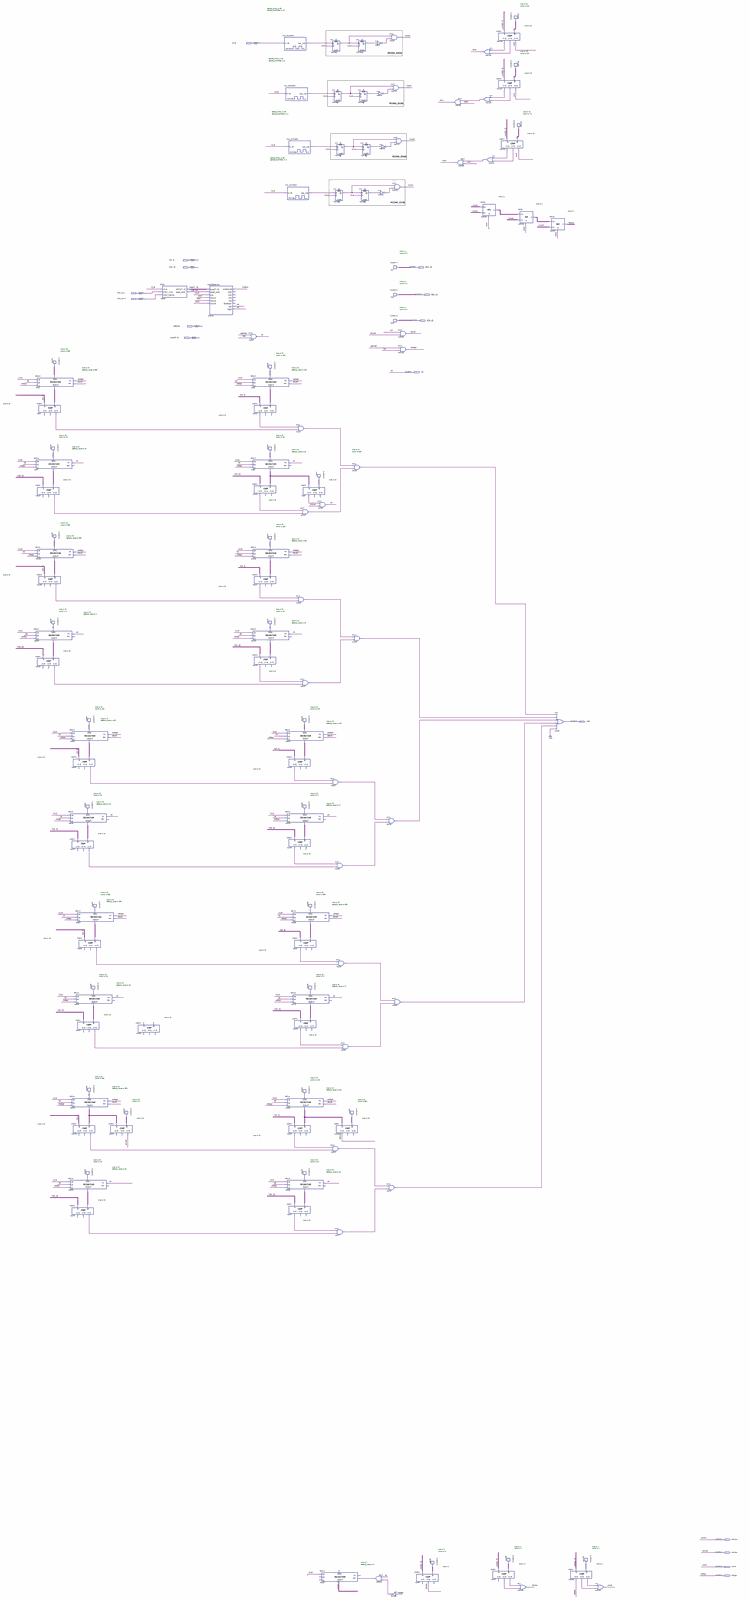
[diagram p0: schematic sheet, whole]
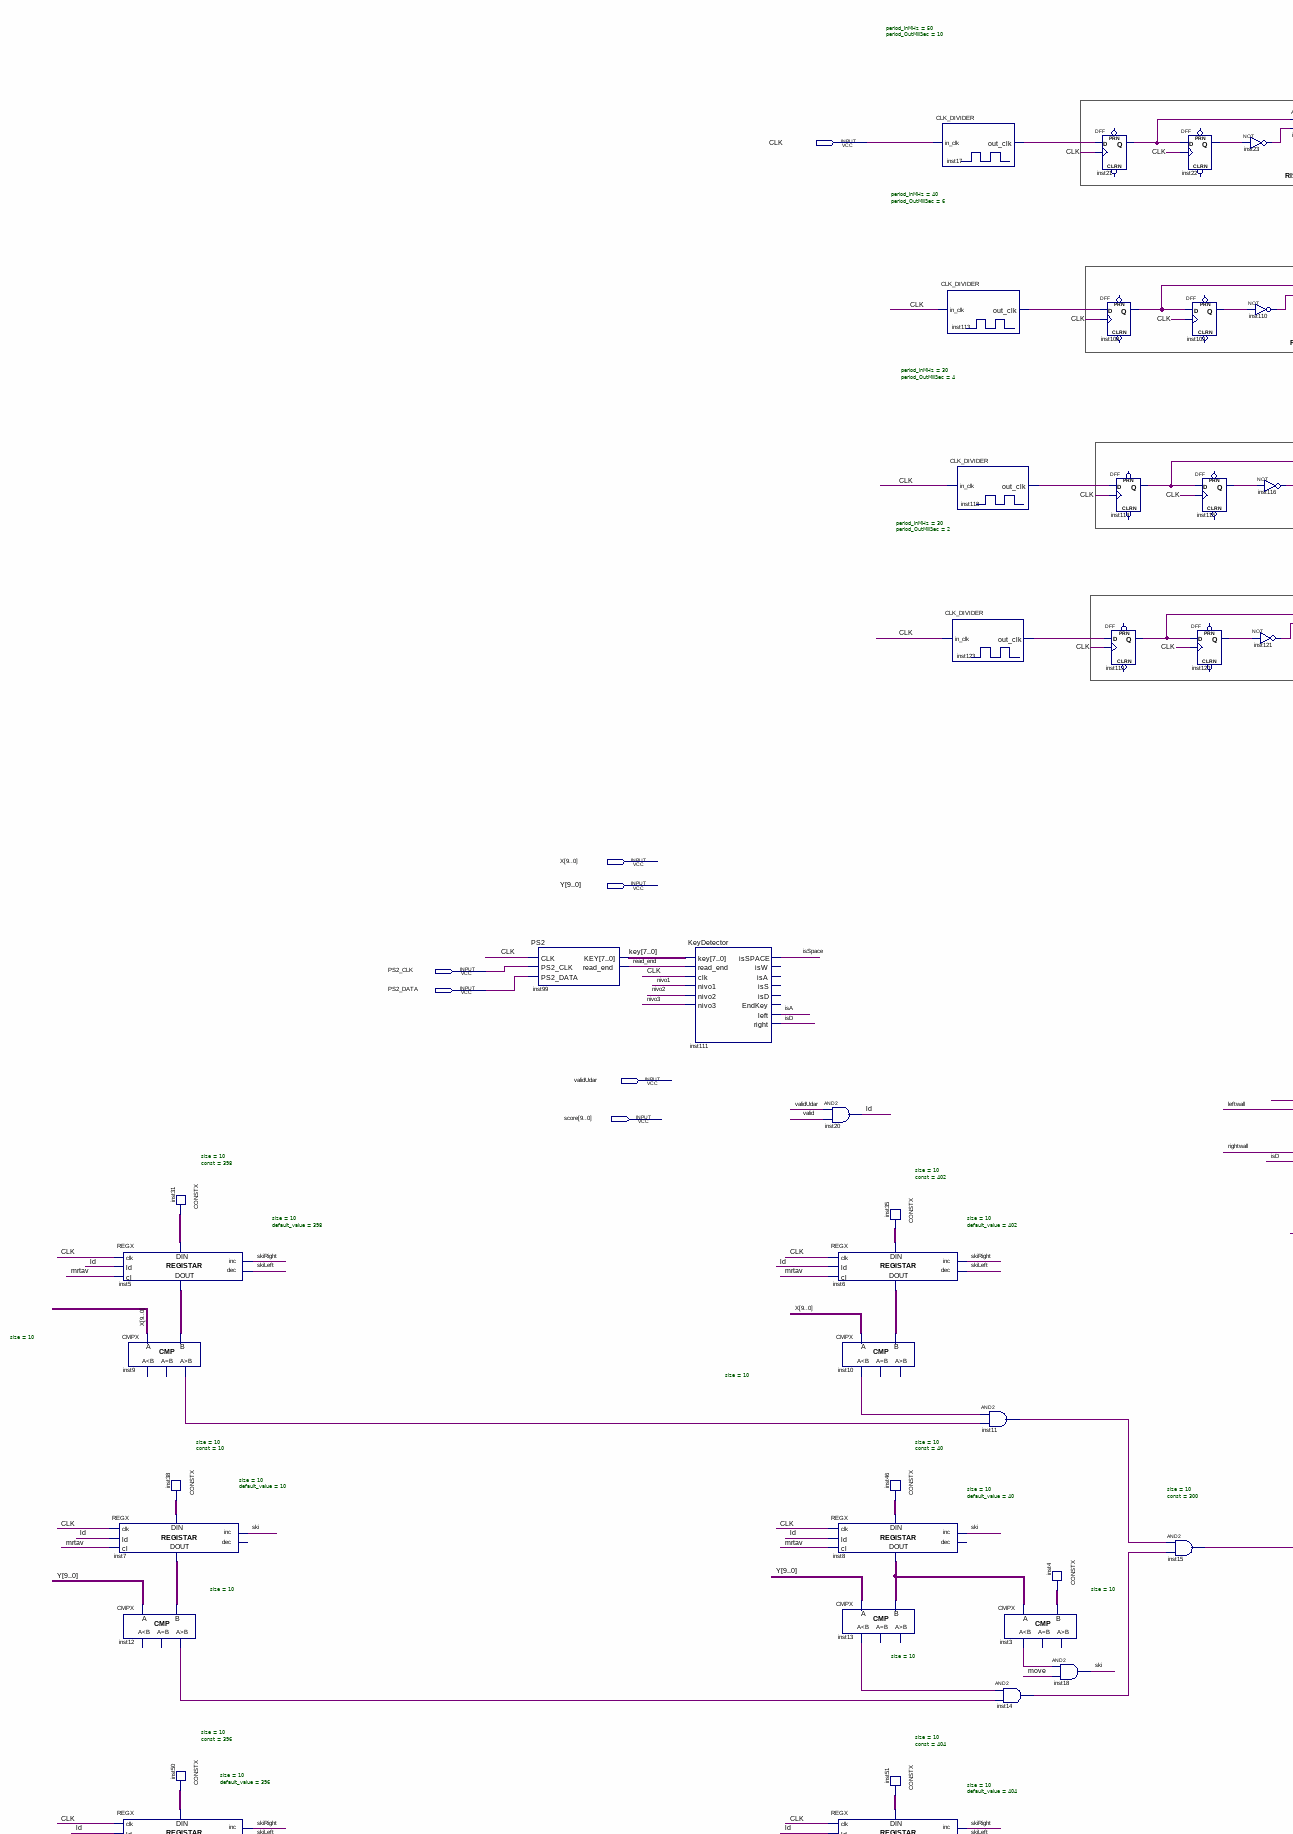
[diagram p1: schematic sheet, upper left part]
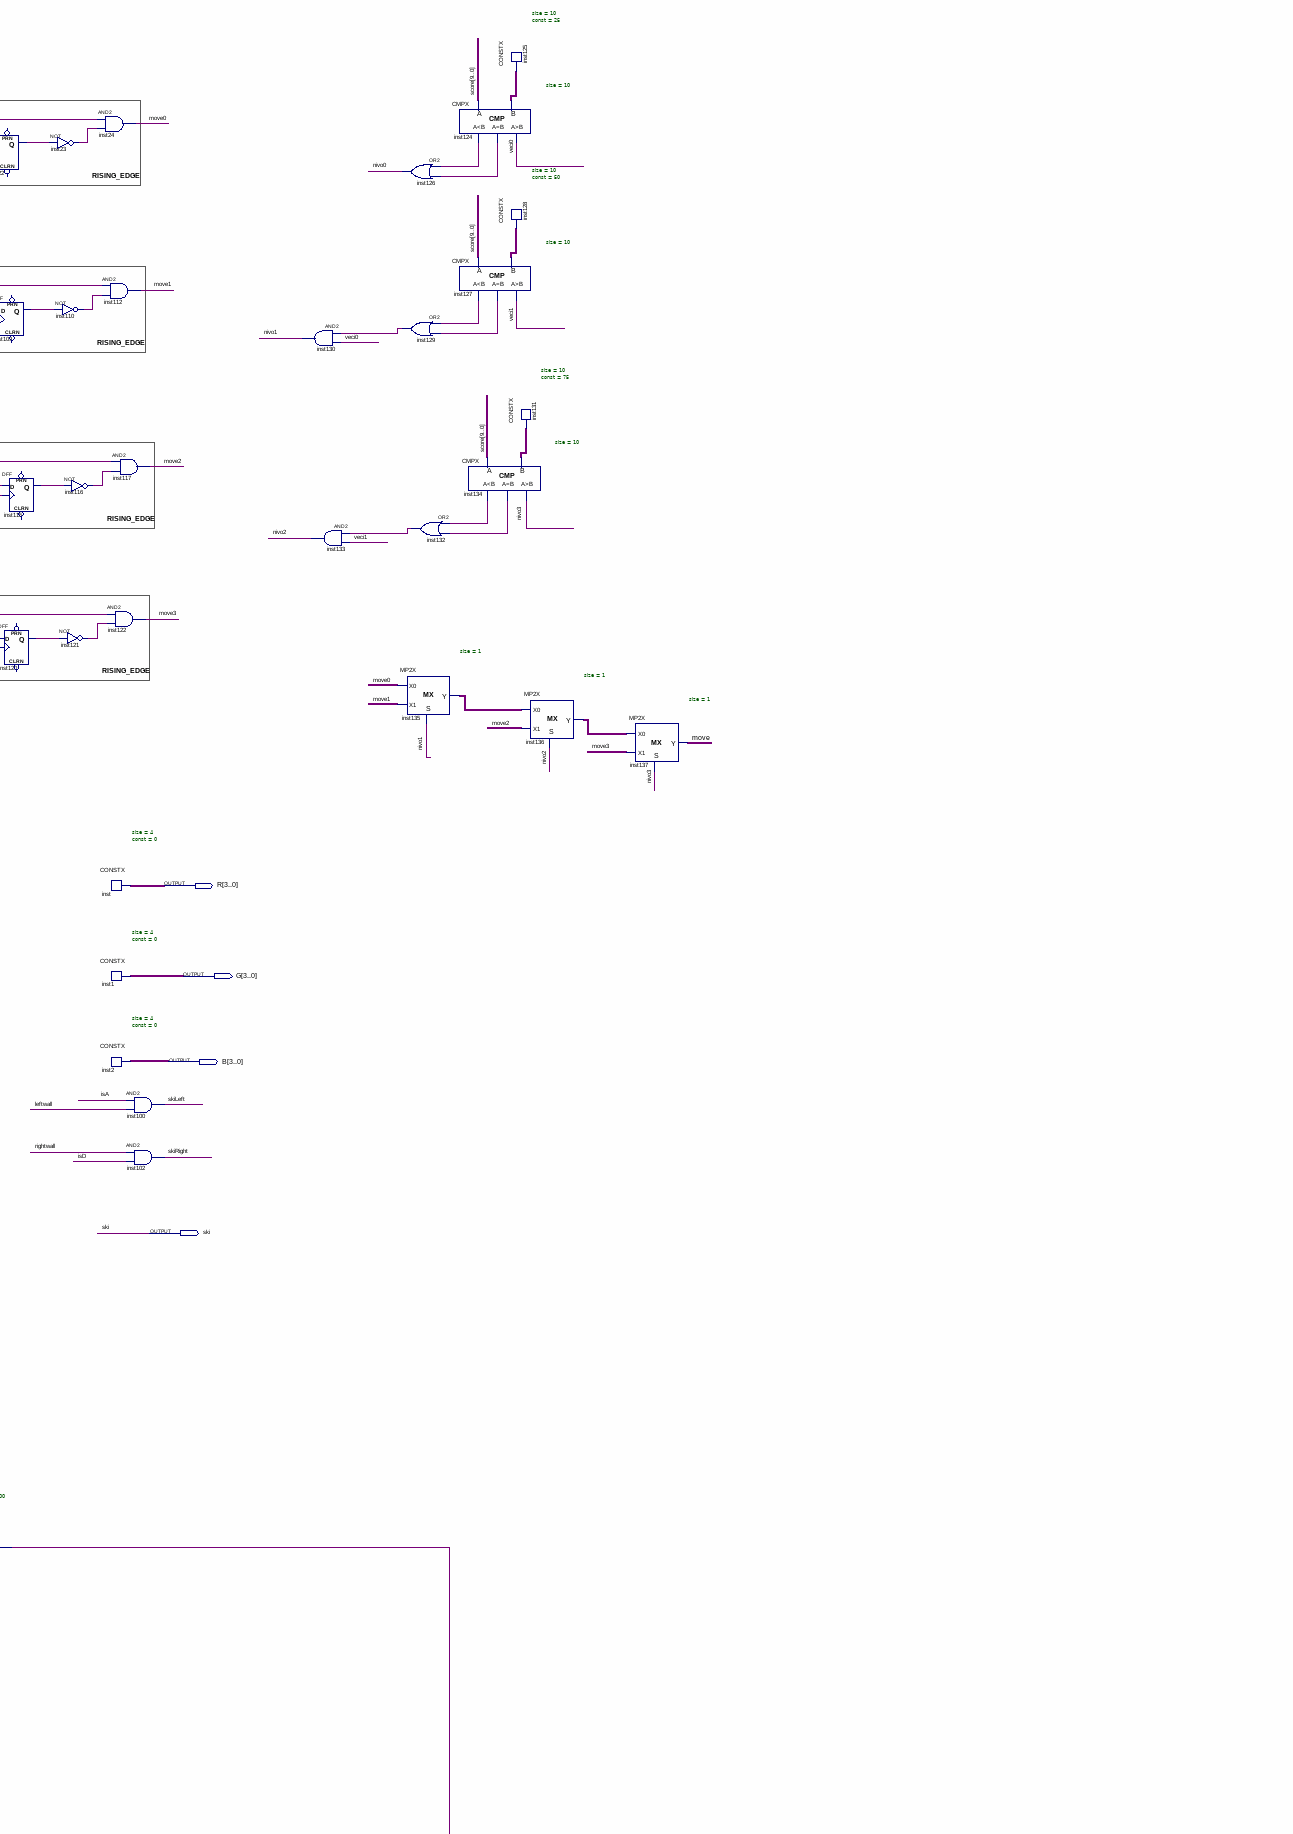
[diagram p2: schematic sheet, upper right part]
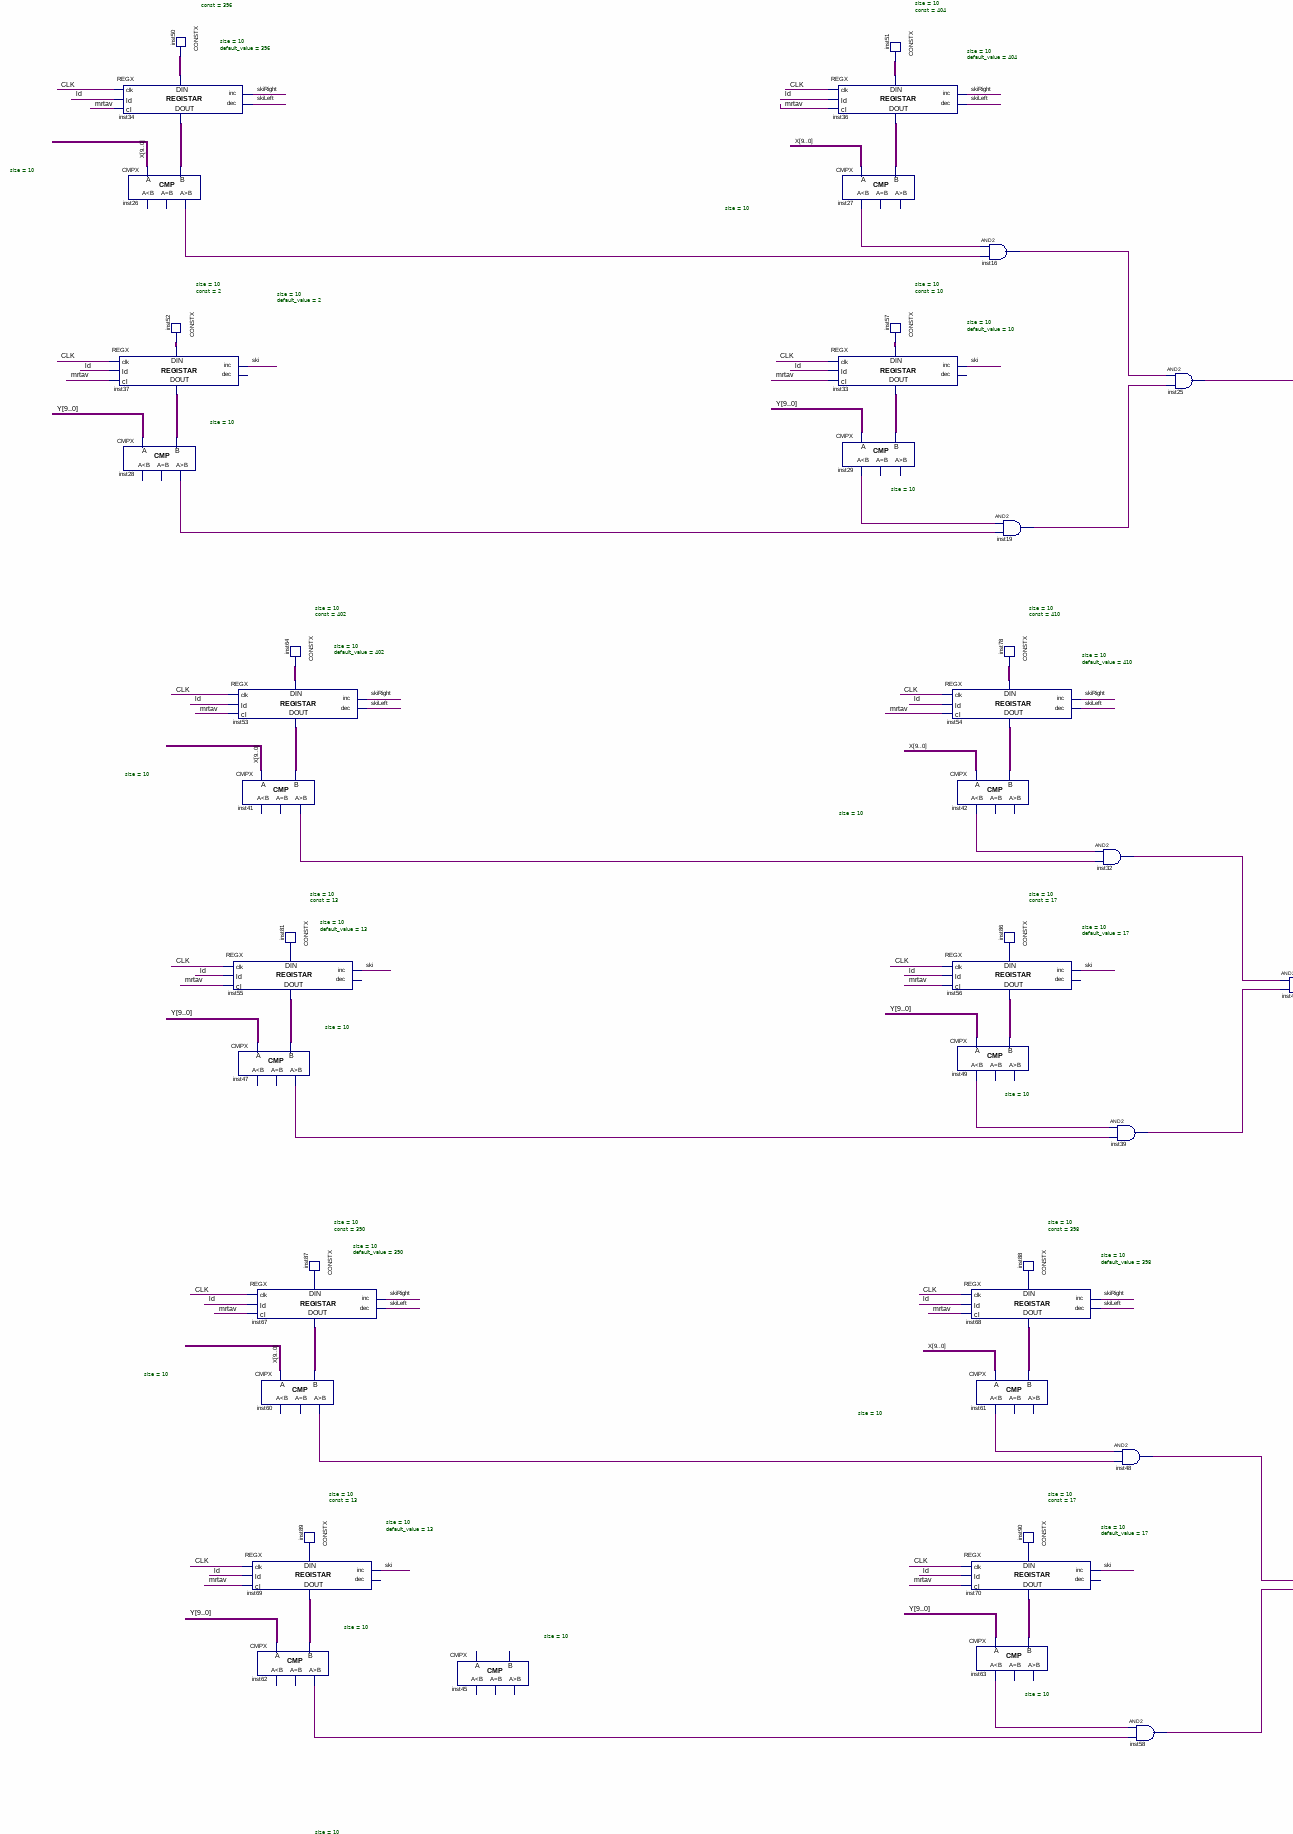
[diagram p3: schematic sheet, middle left part]
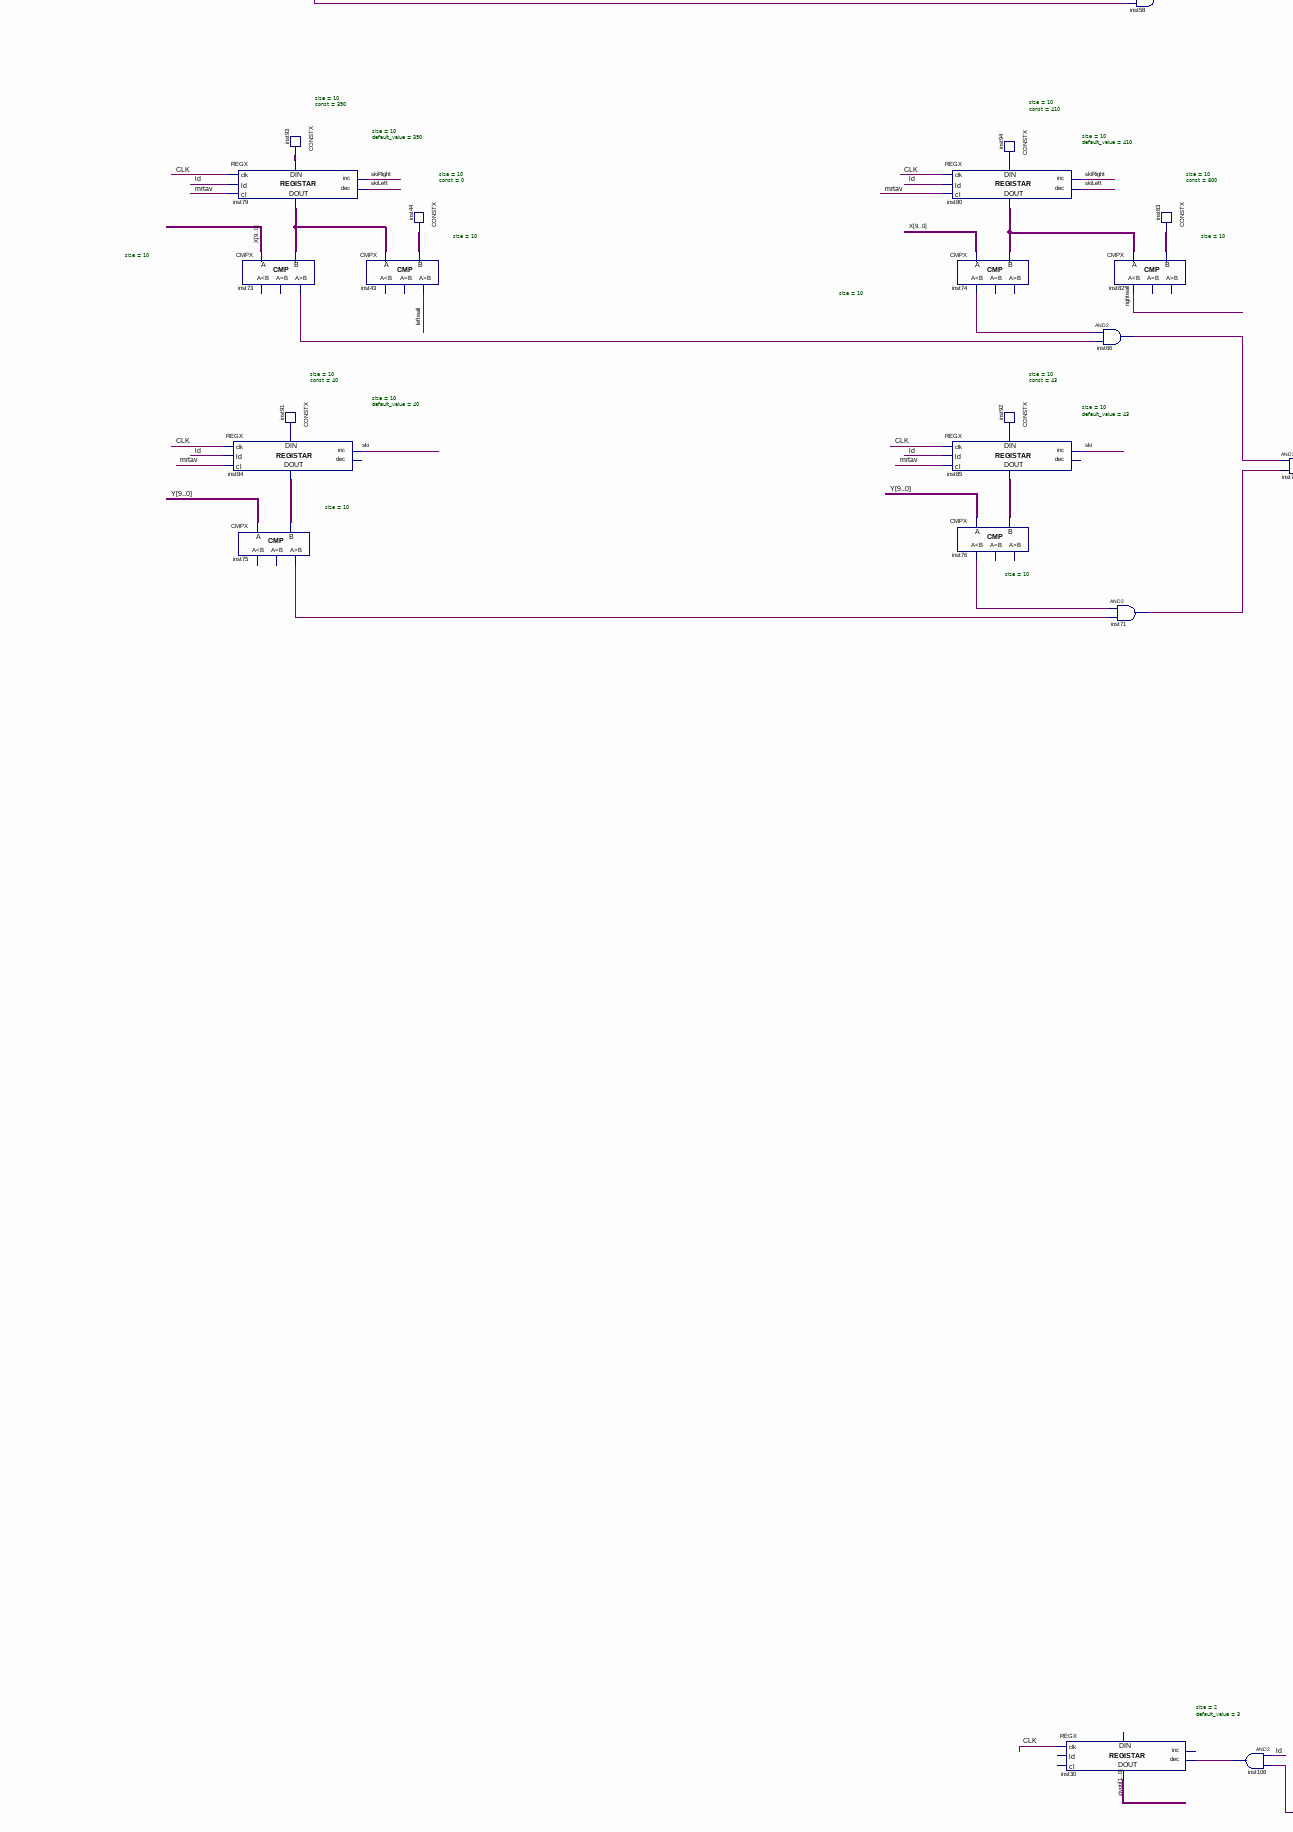
[diagram p4: schematic sheet, lower left part]
// Quartus schematic Skijas.bdf as structural Verilog: 137 symbols, 16 pins
module Skijas (
  input  CLK,
  input  [9:0] X,
  input  [9:0] Y,
  input  PS2_CLK,
  input  PS2_DATA,
  input  validUdar,
  input  [9:0] score,
  output [3:0] R,
  output [3:0] G,
  output [3:0] B,
  output ski,
  output valid,
  output \3zivota ,
  output \2zivota ,
  output \1zivot ,
  output mrtav
);

  wire inst3_ls, inst9_gr, inst10_ls, inst11_out, inst12_gr, inst13_ls, inst14_out, inst15_out, inst16_out,
       inst17_out_clk, inst19_out, inst21_q, inst22_q, inst23_out, inst25_out, inst26_gr, inst27_ls,
       inst28_gr, inst29_ls, inst32_out, inst39_out, inst40_out, inst41_gr, inst42_ls, inst47_gr, inst48_out,
       inst49_ls, inst58_out, inst59_out, inst60_gr, inst61_ls, inst62_gr, inst63_ls, inst66_out, inst71_out,
       inst72_out, inst73_gr, inst74_ls, inst75_gr, inst76_ls, inst97_eq, inst97_gr, inst101_eq, inst101_gr,
       inst106_out, inst107_out, inst108_q, inst109_q, inst110_out, inst113_out_clk, inst114_q, inst115_q,
       inst116_out, inst118_out_clk, inst119_q, inst120_q, inst121_out, inst123_out_clk, inst124_eq,
       inst124_ls, inst127_eq, inst127_ls, inst129_out, inst132_out, inst134_eq, inst134_ls, inst135_y,
       inst136_y, isA, isD, isSpace, ld, leftwall, move, move0, move1, move2, move3, nivo0, nivo1, nivo2,
       nivo3, read_end, rightwall, skiLeft, skiRight, veci0, veci1;
  wire [1:0] inst96_data, inst98_data, inst103_data, zivoti;
  wire [7:0] key;
  wire [9:0] inst4_data, inst5_data_out, inst6_data_out, inst7_data_out, inst8_data_out, inst31_data,
       inst33_data_out, inst34_data_out, inst35_data, inst36_data_out, inst37_data_out, inst38_data,
       inst44_data, inst46_data, inst50_data, inst51_data, inst52_data, inst53_data_out, inst54_data_out,
       inst55_data_out, inst56_data_out, inst57_data, inst64_data, inst67_data_out, inst68_data_out,
       inst69_data_out, inst70_data_out, inst78_data, inst79_data_out, inst80_data_out, inst81_data,
       inst83_data, inst84_data_out, inst85_data_out, inst86_data, inst87_data, inst88_data, inst89_data,
       inst90_data, inst91_data, inst92_data, inst93_data, inst94_data, inst125_data, inst128_data,
       inst131_data;

  REGX #(.size(10), .default_value(398)) inst5 (
    .clk(CLK), .ld(ld), .cl(mrtav), .inc(skiRight), .dec(skiLeft), .data_in(inst31_data),
    .data_out(inst5_data_out));
  CMPX #(.size(10)) inst9 (.A(X), .B(inst5_data_out), .gr(inst9_gr));  // open: ls, eq
  REGX #(.size(10), .default_value(10)) inst7 (
    .clk(CLK), .ld(ld), .cl(mrtav), .inc(ski), .data_in(inst38_data), .data_out(inst7_data_out));  // open: dec
  CMPX #(.size(10)) inst12 (.A(Y), .B(inst7_data_out), .gr(inst12_gr));  // open: ls, eq
  REGX #(.size(10), .default_value(396)) inst34 (
    .clk(CLK), .ld(ld), .cl(mrtav), .inc(skiRight), .dec(skiLeft), .data_in(inst50_data),
    .data_out(inst34_data_out));
  CMPX #(.size(10)) inst26 (.A(X), .B(inst34_data_out), .gr(inst26_gr));  // open: ls, eq
  REGX #(.size(10), .default_value(2)) inst37 (
    .clk(CLK), .ld(ld), .cl(mrtav), .inc(ski), .data_in(inst52_data), .data_out(inst37_data_out));  // open: dec
  CMPX #(.size(10)) inst28 (.A(Y), .B(inst37_data_out), .gr(inst28_gr));  // open: ls, eq
  CONSTX #(.size(10), .\const (398)) inst31 (.data(inst31_data));
  CONSTX #(.size(10), .\const (10)) inst38 (.data(inst38_data));
  CONSTX #(.size(10), .\const (396)) inst50 (.data(inst50_data));
  CONSTX #(.size(10), .\const (2)) inst52 (.data(inst52_data));
  REGX #(.size(10), .default_value(402)) inst53 (
    .clk(CLK), .ld(ld), .cl(mrtav), .inc(skiRight), .dec(skiLeft), .data_in(inst64_data),
    .data_out(inst53_data_out));
  CMPX #(.size(10)) inst41 (.A(X), .B(inst53_data_out), .gr(inst41_gr));  // open: ls, eq
  REGX #(.size(10), .default_value(13)) inst55 (
    .clk(CLK), .ld(ld), .cl(mrtav), .inc(ski), .data_in(inst81_data), .data_out(inst55_data_out));  // open: dec
  CMPX #(.size(10)) inst47 (.A(Y), .B(inst55_data_out), .gr(inst47_gr));  // open: ls, eq
  REGX #(.size(10), .default_value(390)) inst67 (
    .clk(CLK), .ld(ld), .cl(mrtav), .inc(skiRight), .dec(skiLeft), .data_in(inst87_data),
    .data_out(inst67_data_out));
  REGX #(.size(10), .default_value(13)) inst69 (
    .clk(CLK), .ld(ld), .cl(mrtav), .inc(ski), .data_in(inst89_data), .data_out(inst69_data_out));  // open: dec
  CMPX #(.size(10)) inst62 (.A(Y), .B(inst69_data_out), .gr(inst62_gr));  // open: ls, eq
  REGX #(.size(10), .default_value(390)) inst79 (
    .clk(CLK), .ld(ld), .cl(mrtav), .inc(skiRight), .dec(skiLeft), .data_in(inst93_data),
    .data_out(inst79_data_out));
  CMPX #(.size(10)) inst73 (.A(X), .B(inst79_data_out), .gr(inst73_gr));  // open: ls, eq
  REGX #(.size(10), .default_value(40)) inst84 (
    .clk(CLK), .ld(ld), .cl(mrtav), .inc(ski), .data_in(inst91_data), .data_out(inst84_data_out));  // open: dec
  CMPX #(.size(10)) inst75 (.A(Y), .B(inst84_data_out), .gr(inst75_gr));  // open: ls, eq
  CONSTX #(.size(10), .\const (402)) inst64 (.data(inst64_data));
  CONSTX #(.size(10), .\const (13)) inst81 (.data(inst81_data));
  CMPX #(.size(10)) inst60 (.A(X), .B(inst67_data_out), .gr(inst60_gr));  // open: ls, eq
  CONSTX #(.size(10), .\const (390)) inst93 (.data(inst93_data));
  CONSTX #(.size(10), .\const (40)) inst91 (.data(inst91_data));
  CONSTX #(.size(10), .\const (390)) inst87 (.data(inst87_data));
  CONSTX #(.size(10), .\const (13)) inst89 (.data(inst89_data));
  CMPX #(.size(10)) inst43 (.A(inst79_data_out), .B(inst44_data), .gr(leftwall));  // open: ls, eq
  CONSTX #(.size(10), .\const (0)) inst44 (.data(inst44_data));
  CMPX #(.size(10)) inst45 ();  // open: A, B, ls, eq, gr
  PS2 inst99 (.CLK(CLK), .PS2_CLK(PS2_CLK), .PS2_DATA(PS2_DATA), .KEY(key), .read_end(read_end));
  KeyDetector inst111 (
    .key(key), .read_end(read_end), .clk(CLK), .nivo1(nivo1), .nivo2(nivo2), .nivo3(nivo3),
    .isSPACE(isSpace), .left(isA), .right(isD));  // open: isW, isA, isS, isD, EndKey
  and inst20 (ld, validUdar, valid);
  REGX #(.size(10), .default_value(402)) inst6 (
    .clk(CLK), .ld(ld), .cl(mrtav), .inc(skiRight), .dec(skiLeft), .data_in(inst35_data),
    .data_out(inst6_data_out));
  CMPX #(.size(10)) inst10 (.A(X), .B(inst6_data_out), .ls(inst10_ls));  // open: eq, gr
  REGX #(.size(10), .default_value(40)) inst8 (
    .clk(CLK), .ld(ld), .cl(mrtav), .inc(ski), .data_in(inst46_data), .data_out(inst8_data_out));  // open: dec
  CMPX #(.size(10)) inst13 (.A(Y), .B(inst8_data_out), .ls(inst13_ls));  // open: eq, gr
  REGX #(.size(10), .default_value(404)) inst36 (
    .clk(CLK), .ld(ld), .cl(mrtav), .inc(skiRight), .dec(skiLeft), .data_in(inst51_data),
    .data_out(inst36_data_out));
  CMPX #(.size(10)) inst27 (.A(X), .B(inst36_data_out), .ls(inst27_ls));  // open: eq, gr
  REGX #(.size(10), .default_value(10)) inst33 (
    .clk(CLK), .ld(ld), .cl(mrtav), .inc(ski), .data_in(inst57_data), .data_out(inst33_data_out));  // open: dec
  CMPX #(.size(10)) inst29 (.A(Y), .B(inst33_data_out), .ls(inst29_ls));  // open: eq, gr
  CONSTX #(.size(10), .\const (402)) inst35 (.data(inst35_data));
  CONSTX #(.size(10), .\const (40)) inst46 (.data(inst46_data));
  CONSTX #(.size(10), .\const (404)) inst51 (.data(inst51_data));
  CONSTX #(.size(10), .\const (10)) inst57 (.data(inst57_data));
  CLK_DIVIDER #(.period_InMHz(50), .period_OutMiliSec(10)) inst17 (.in_clk(CLK), .out_clk(inst17_out_clk));
  CLK_DIVIDER #(.period_InMHz(40), .period_OutMiliSec(6)) inst113 (.in_clk(CLK), .out_clk(inst113_out_clk));
  CLK_DIVIDER #(.period_InMHz(30), .period_OutMiliSec(4)) inst118 (.in_clk(CLK), .out_clk(inst118_out_clk));
  CLK_DIVIDER #(.period_InMHz(30), .period_OutMiliSec(2)) inst123 (.in_clk(CLK), .out_clk(inst123_out_clk));
  REGX #(.size(10), .default_value(410)) inst54 (
    .clk(CLK), .ld(ld), .cl(mrtav), .inc(skiRight), .dec(skiLeft), .data_in(inst78_data),
    .data_out(inst54_data_out));
  CMPX #(.size(10)) inst42 (.A(X), .B(inst54_data_out), .ls(inst42_ls));  // open: eq, gr
  REGX #(.size(10), .default_value(17)) inst56 (
    .clk(CLK), .ld(ld), .cl(mrtav), .inc(ski), .data_in(inst86_data), .data_out(inst56_data_out));  // open: dec
  CMPX #(.size(10)) inst49 (.A(Y), .B(inst56_data_out), .ls(inst49_ls));  // open: eq, gr
  REGX #(.size(10), .default_value(398)) inst68 (
    .clk(CLK), .ld(ld), .cl(mrtav), .inc(skiRight), .dec(skiLeft), .data_in(inst88_data),
    .data_out(inst68_data_out));
  CMPX #(.size(10)) inst61 (.A(X), .B(inst68_data_out), .ls(inst61_ls));  // open: eq, gr
  REGX #(.size(10), .default_value(17)) inst70 (
    .clk(CLK), .ld(ld), .cl(mrtav), .inc(ski), .data_in(inst90_data), .data_out(inst70_data_out));  // open: dec
  CMPX #(.size(10)) inst63 (.A(Y), .B(inst70_data_out), .ls(inst63_ls));  // open: eq, gr
  REGX #(.size(10), .default_value(410)) inst80 (
    .clk(CLK), .ld(ld), .cl(mrtav), .inc(skiRight), .dec(skiLeft), .data_in(inst94_data),
    .data_out(inst80_data_out));
  CMPX #(.size(10)) inst74 (.A(X), .B(inst80_data_out), .ls(inst74_ls));  // open: eq, gr
  REGX #(.size(10), .default_value(43)) inst85 (
    .clk(CLK), .ld(ld), .cl(mrtav), .inc(ski), .data_in(inst92_data), .data_out(inst85_data_out));  // open: dec
  CMPX #(.size(10)) inst76 (.A(Y), .B(inst85_data_out), .ls(inst76_ls));  // open: eq, gr
  and inst11 (inst11_out, inst10_ls, inst9_gr);
  CMPX #(.size(10)) inst3 (.A(inst8_data_out), .B(inst4_data), .ls(inst3_ls));  // open: eq, gr
  and inst14 (inst14_out, inst13_ls, inst12_gr);
  and inst16 (inst16_out, inst27_ls, inst26_gr);
  and inst19 (inst19_out, inst29_ls, inst28_gr);
  CONSTX #(.size(10), .\const (410)) inst78 (.data(inst78_data));
  CONSTX #(.size(10), .\const (17)) inst86 (.data(inst86_data));
  CONSTX #(.size(10), .\const (410)) inst94 (.data(inst94_data));
  CONSTX #(.size(10), .\const (43)) inst92 (.data(inst92_data));
  CONSTX #(.size(10), .\const (300)) inst4 (.data(inst4_data));
  CONSTX #(.size(10), .\const (398)) inst88 (.data(inst88_data));
  CONSTX #(.size(10), .\const (17)) inst90 (.data(inst90_data));
  and inst18 (ski, inst3_ls, move);
  REGX #(.size(2), .default_value(3)) inst30 (
    .clk(CLK), .dec(inst106_out), .data_out(zivoti));  // open: ld, cl, inc, data_in
  DFF inst21 (.CLK(CLK), .D(inst17_out_clk), .Q(inst21_q));  // open: CLRN, PRN
  DFF inst108 (.CLK(CLK), .D(inst113_out_clk), .Q(inst108_q));  // open: CLRN, PRN
  DFF inst114 (.CLK(CLK), .D(inst118_out_clk), .Q(inst114_q));  // open: CLRN, PRN
  DFF inst119 (.CLK(CLK), .D(inst123_out_clk), .Q(inst119_q));  // open: CLRN, PRN
  and inst32 (inst32_out, inst42_ls, inst41_gr);
  and inst39 (inst39_out, inst49_ls, inst47_gr);
  and inst48 (inst48_out, inst61_ls, inst60_gr);
  CMPX #(.size(10)) inst82 (.A(inst80_data_out), .B(inst83_data), .ls(rightwall));  // open: eq, gr
  and inst66 (inst66_out, inst74_ls, inst73_gr);
  and inst71 (inst71_out, inst76_ls, inst75_gr);
  and inst58 (inst58_out, inst63_ls, inst62_gr);
  CONSTX #(.size(10), .\const (800)) inst83 (.data(inst83_data));
  DFF inst22 (.CLK(CLK), .D(inst21_q), .Q(inst22_q));  // open: CLRN, PRN
  DFF inst109 (.CLK(CLK), .D(inst108_q), .Q(inst109_q));  // open: CLRN, PRN
  DFF inst115 (.CLK(CLK), .D(inst114_q), .Q(inst115_q));  // open: CLRN, PRN
  DFF inst120 (.CLK(CLK), .D(inst119_q), .Q(inst120_q));  // open: CLRN, PRN
  and inst15 (inst15_out, inst11_out, inst14_out);
  and inst25 (inst25_out, inst16_out, inst19_out);
  and inst106 (inst106_out, ld, inst107_out);
  not inst23 (inst23_out, inst22_q);
  not inst110 (inst110_out, inst109_q);
  not inst116 (inst116_out, inst115_q);
  not inst121 (inst121_out, inst120_q);
  and inst24 (move0, inst21_q, inst23_out);
  and inst112 (move1, inst108_q, inst110_out);
  and inst117 (move2, inst114_q, inst116_out);
  and inst122 (move3, inst119_q, inst121_out);
  CONSTX #(.size(4), .\const (0)) inst (.data(R));
  CONSTX #(.size(4), .\const (0)) inst1 (.data(G));
  CONSTX #(.size(4), .\const (0)) inst2 (.data(B));
  and inst40 (inst40_out, inst32_out, inst39_out);
  and inst59 (inst59_out, inst48_out, inst58_out);
  and inst72 (inst72_out, inst66_out, inst71_out);
  not inst107 (inst107_out, mrtav);
  and inst100 (skiLeft, isA, leftwall);
  and inst102 (skiRight, rightwall, isD);
  CMPX #(.size(2)) inst95 (.A(zivoti), .B(inst96_data), .eq(\3zivota ));  // open: ls, gr
  CONSTX #(.size(2), .\const (3)) inst96 (.data(inst96_data));
  and inst130 (nivo1, inst129_out, veci0);
  and inst133 (nivo2, inst132_out, veci1);
  or inst126 (nivo0, inst124_ls, inst124_eq);
  or inst129 (inst129_out, inst127_ls, inst127_eq);
  or inst132 (inst132_out, inst134_ls, inst134_eq);
  MP2X #(.size(1)) inst135 (.S(nivo1), .X0(move0), .X1(move1), .Y(inst135_y));
  CMPX #(.size(10)) inst124 (.A(score), .B(inst125_data), .ls(inst124_ls), .eq(inst124_eq), .gr(veci0));
  CMPX #(.size(10)) inst127 (.A(score), .B(inst128_data), .ls(inst127_ls), .eq(inst127_eq), .gr(veci1));
  CMPX #(.size(10)) inst134 (.A(score), .B(inst131_data), .ls(inst134_ls), .eq(inst134_eq), .gr(nivo3));
  CMPX #(.size(2)) inst97 (.A(zivoti), .B(inst98_data), .eq(inst97_eq), .gr(inst97_gr));  // open: ls
  CONSTX #(.size(10), .\const (25)) inst125 (.data(inst125_data));
  CONSTX #(.size(10), .\const (50)) inst128 (.data(inst128_data));
  CONSTX #(.size(2), .\const (2)) inst98 (.data(inst98_data));
  CONSTX #(.size(10), .\const (75)) inst131 (.data(inst131_data));
  MP2X #(.size(1)) inst136 (.S(nivo2), .X0(inst135_y), .X1(move2), .Y(inst136_y));
  or inst104 (\2zivota , inst97_gr, inst97_eq);
  MP2X #(.size(1)) inst137 (.S(nivo3), .X0(inst136_y), .X1(move3), .Y(move));
  or inst65 (valid, inst15_out, inst25_out, inst40_out, inst59_out, inst72_out, 1'b0);
  CMPX #(.size(2)) inst101 (.A(zivoti), .B(inst103_data), .ls(mrtav), .eq(inst101_eq), .gr(inst101_gr));
  CONSTX #(.size(2), .\const (1)) inst103 (.data(inst103_data));
  or inst105 (\1zivot , inst101_gr, inst101_eq);

  // Notes on the sheet:
  //   RISING_EDGE
  //   RISING_EDGE
  //   RISING_EDGE
  //   RISING_EDGE
endmodule
